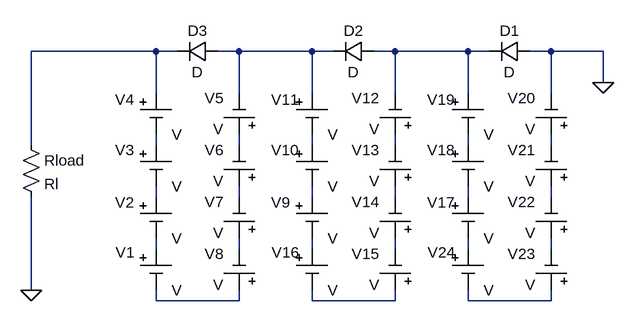
[diagram p0: schematic bd.asc]
bd.asc, the LTspice schematic file:
Version 4
SHEET 1 880 680
WIRE 144 -160 -48 -160
WIRE 176 -160 144 -160
WIRE 272 -160 240 -160
WIRE 384 -160 272 -160
WIRE 416 -160 384 -160
WIRE 512 -160 480 -160
WIRE 624 -160 512 -160
WIRE 656 -160 624 -160
WIRE 752 -160 720 -160
WIRE 832 -160 752 -160
WIRE 832 -112 832 -160
WIRE 144 -96 144 -160
WIRE 272 -96 272 -160
WIRE 384 -96 384 -160
WIRE 512 -96 512 -160
WIRE 624 -96 624 -160
WIRE 752 -96 752 -160
WIRE -48 -16 -48 -160
WIRE 144 -16 144 -32
WIRE 272 -16 272 -32
WIRE 384 -16 384 -32
WIRE 512 -16 512 -32
WIRE 624 -16 624 -32
WIRE 752 -16 752 -32
WIRE 144 64 144 48
WIRE 272 64 272 48
WIRE 384 64 384 48
WIRE 512 64 512 48
WIRE 624 64 624 48
WIRE 752 64 752 48
WIRE 144 144 144 128
WIRE 272 144 272 128
WIRE 384 144 384 128
WIRE 512 144 512 128
WIRE 624 144 624 128
WIRE 752 144 752 128
WIRE -48 208 -48 64
WIRE 144 224 144 208
WIRE 272 224 272 208
WIRE 272 224 144 224
WIRE 384 224 384 208
WIRE 512 224 512 208
WIRE 512 224 384 224
WIRE 624 224 624 208
WIRE 752 224 752 208
WIRE 752 224 624 224
FLAG 832 -112 0
FLAG -48 208 0
SYMBOL Misc\\cell 144 64 R0
WINDOW 0 -63 9 Left 2
SYMATTR InstName V2
SYMBOL Misc\\cell 144 -16 R0
WINDOW 0 -63 8 Left 2
SYMATTR InstName V3
SYMBOL Misc\\cell 144 -96 R0
WINDOW 0 -63 10 Left 2
SYMATTR InstName V4
SYMBOL Misc\\cell 272 -32 R180
WINDOW 0 24 56 Left 2
WINDOW 3 24 8 Left 2
SYMATTR InstName V5
SYMBOL Misc\\cell 272 48 R180
WINDOW 0 24 56 Left 2
WINDOW 3 24 8 Left 2
SYMATTR InstName V6
SYMBOL Misc\\cell 272 128 R180
WINDOW 0 24 56 Left 2
WINDOW 3 24 8 Left 2
SYMATTR InstName V7
SYMBOL Misc\\cell 272 208 R180
WINDOW 0 24 56 Left 2
WINDOW 3 24 8 Left 2
SYMATTR InstName V8
SYMBOL Misc\\cell 144 144 R0
WINDOW 0 -62 6 Left 2
SYMATTR InstName V1
SYMBOL Misc\\cell 384 64 R0
WINDOW 0 -63 9 Left 2
SYMATTR InstName V9
SYMBOL Misc\\cell 384 -16 R0
WINDOW 0 -63 8 Left 2
SYMATTR InstName V10
SYMBOL Misc\\cell 384 -96 R0
WINDOW 0 -63 10 Left 2
SYMATTR InstName V11
SYMBOL Misc\\cell 512 -32 R180
WINDOW 0 24 56 Left 2
WINDOW 3 24 8 Left 2
SYMATTR InstName V12
SYMBOL Misc\\cell 512 48 R180
WINDOW 0 24 56 Left 2
WINDOW 3 24 8 Left 2
SYMATTR InstName V13
SYMBOL Misc\\cell 512 128 R180
WINDOW 0 24 56 Left 2
WINDOW 3 24 8 Left 2
SYMATTR InstName V14
SYMBOL Misc\\cell 512 208 R180
WINDOW 0 24 56 Left 2
WINDOW 3 24 8 Left 2
SYMATTR InstName V15
SYMBOL Misc\\cell 384 144 R0
WINDOW 0 -62 6 Left 2
SYMATTR InstName V16
SYMBOL Misc\\cell 624 64 R0
WINDOW 0 -63 9 Left 2
SYMATTR InstName V17
SYMBOL Misc\\cell 624 -16 R0
WINDOW 0 -63 8 Left 2
SYMATTR InstName V18
SYMBOL Misc\\cell 624 -96 R0
WINDOW 0 -63 10 Left 2
SYMATTR InstName V19
SYMBOL Misc\\cell 752 -32 R180
WINDOW 0 24 56 Left 2
WINDOW 3 24 8 Left 2
SYMATTR InstName V20
SYMBOL Misc\\cell 752 48 R180
WINDOW 0 24 56 Left 2
WINDOW 3 24 8 Left 2
SYMATTR InstName V21
SYMBOL Misc\\cell 752 128 R180
WINDOW 0 24 56 Left 2
WINDOW 3 24 8 Left 2
SYMATTR InstName V22
SYMBOL Misc\\cell 752 208 R180
WINDOW 0 24 56 Left 2
WINDOW 3 24 8 Left 2
SYMATTR InstName V23
SYMBOL Misc\\cell 624 144 R0
WINDOW 0 -62 6 Left 2
SYMATTR InstName V24
SYMBOL diode 720 -176 R90
WINDOW 0 0 32 VBottom 2
WINDOW 3 32 32 VTop 2
SYMATTR InstName D1
SYMBOL diode 480 -176 R90
WINDOW 0 0 32 VBottom 2
WINDOW 3 32 32 VTop 2
SYMATTR InstName D2
SYMBOL diode 240 -176 R90
WINDOW 0 0 32 VBottom 2
WINDOW 3 32 32 VTop 2
SYMATTR InstName D3
SYMBOL res -64 -32 R0
SYMATTR InstName Rload
SYMATTR Value Rl

The netlist it stands for:
* bd.asc
V2 N010 N016 V
V3 N004 N010 V
V4 N001 N004 V
V5 N005 N002 V
V6 N011 N005 V
V7 N017 N011 V
V8 N022 N017 V
V1 N016 N022 V
V9 N012 N018 V
V10 N006 N012 V
V11 N002 N006 V
V12 N007 N003 V
V13 N013 N007 V
V14 N019 N013 V
V15 N023 N019 V
V16 N018 N023 V
V17 N014 N020 V
V18 N008 N014 V
V19 N003 N008 V
V20 N009 0 V
V21 N015 N009 V
V22 N021 N015 V
V23 N024 N021 V
V24 N020 N024 V
D1 0 N003 D
D2 N003 N002 D
D3 N002 N001 D
Rload N001 0 Rl
.model D D
.lib standard.dio
.backanno
.end